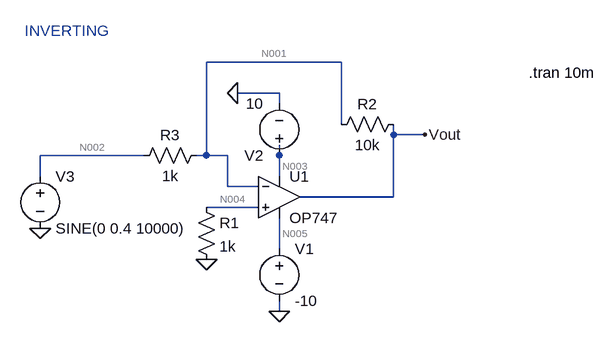
[diagram p0: schematic inv_opamp.asc]
inv_opamp.asc, the LTspice schematic file:
Version 4.1
SHEET 1 880 680
WIRE 288 -208 80 -208
WIRE 192 -160 128 -160
WIRE 192 -144 192 -160
WIRE 288 -112 288 -208
WIRE 368 -96 368 -112
WIRE 416 -96 368 -96
WIRE -16 -64 -176 -64
WIRE 80 -64 80 -208
WIRE 80 -64 64 -64
WIRE 112 -64 80 -64
WIRE 192 -64 192 -80
WIRE -176 -32 -176 -64
WIRE 192 -32 192 -64
WIRE 112 -16 112 -64
WIRE 160 -16 112 -16
WIRE 368 0 368 -96
WIRE 368 0 224 0
WIRE 160 16 80 16
WIRE 192 80 192 32
WIRE 192 176 192 160
FLAG 192 176 0
FLAG 80 96 0
FLAG -176 48 0
FLAG 128 -160 0
FLAG 416 -96 Vout
SYMBOL OpAmps\\OP747 192 -64 R0
SYMATTR InstName U1
SYMBOL res 64 0 R0
SYMATTR InstName R1
SYMATTR Value 1k
SYMBOL res 384 -128 R90
WINDOW 0 0 56 VBottom 2
WINDOW 3 32 56 VTop 2
SYMATTR InstName R2
SYMATTR Value 10k
SYMBOL res 80 -80 R90
WINDOW 0 0 56 VBottom 2
WINDOW 3 32 56 VTop 2
SYMATTR InstName R3
SYMATTR Value 1k
SYMBOL voltage 192 64 R0
WINDOW 123 0 0 Left 0
WINDOW 39 0 0 Left 0
SYMATTR InstName V1
SYMATTR Value -10
SYMBOL voltage 192 -48 R180
WINDOW 123 0 0 Left 0
WINDOW 39 0 0 Left 0
SYMATTR InstName V2
SYMATTR Value 10
SYMBOL voltage -176 -48 R0
WINDOW 123 0 0 Left 0
WINDOW 39 0 0 Left 0
SYMATTR InstName V3
SYMATTR Value SINE(0 0.4 10000)
TEXT 576 -192 Left 2 !.tran 10m
TEXT -200 -256 Left 2 ;INVERTING

The netlist it stands for:
* inv_opamp.asc
X§U1 N004 N001 N003 N005 Vout OP747  ; pins In+ In- V+ V- OUT
R1 N004 0 1k
R2 Vout N001 10k
R3 N001 N002 1k
V1 N005 0 -10
V2 N003 0 10
V3 N002 0 SINE(0 0.4 10000)
.tran 10m
* INVERTING
.backanno
.end

* Results of the author's LTspice run, read from the files saved beside the schematic
* Operating Point, zero values left out:
*   V(n001) = 91.21 µV
*   V(n005) = -10 V
*   V(vout) = 911.2 µV
*   V(n004) = 11.21 µV
*   V(n003) = 10 V
*   I(R3) = 91.21 nA
*   I(R1) = 11.21 nA
*   I(V3) = 91.21 nA
*   I(R2) = 82 nA
*   I(V1) = 268.5 µA
*   I(V2) = -268.6 µA
*   Ix(u1:1) = -11.21 nA
*   Ix(u1:2) = -9.214 nA
*   Ix(u1:99) = 268.6 µA
*   Ix(u1:50) = -268.5 µA
*   Ix(u1:45) = -82 nA
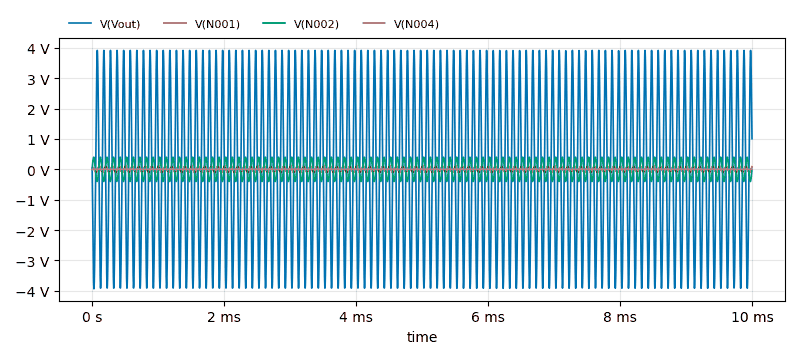
[diagram p1: Transient Analysis of inv_opamp.asc, plotted from the saved traces]
* Transient Analysis, 1 run:
*   V(Vout): min -3.935 V, max 3.919 V, average 364.7 µV, rms 2.693 V, last 1.007 V
*   V(N001): min -112.7 mV, max 113.2 mV, average 78.37 µV, rms 72.51 mV, last 91.58 mV
*   V(N002): min -400 mV, max 400 mV, average 40.51 µV, rms 284.7 mV, last 0 V
*   V(N004): min 1.249 µV, max 21.21 µV, average 11.22 µV, rms 13.7 µV, last 20.88 µV